# Altium schematic sheet power.SchDoc
size A4
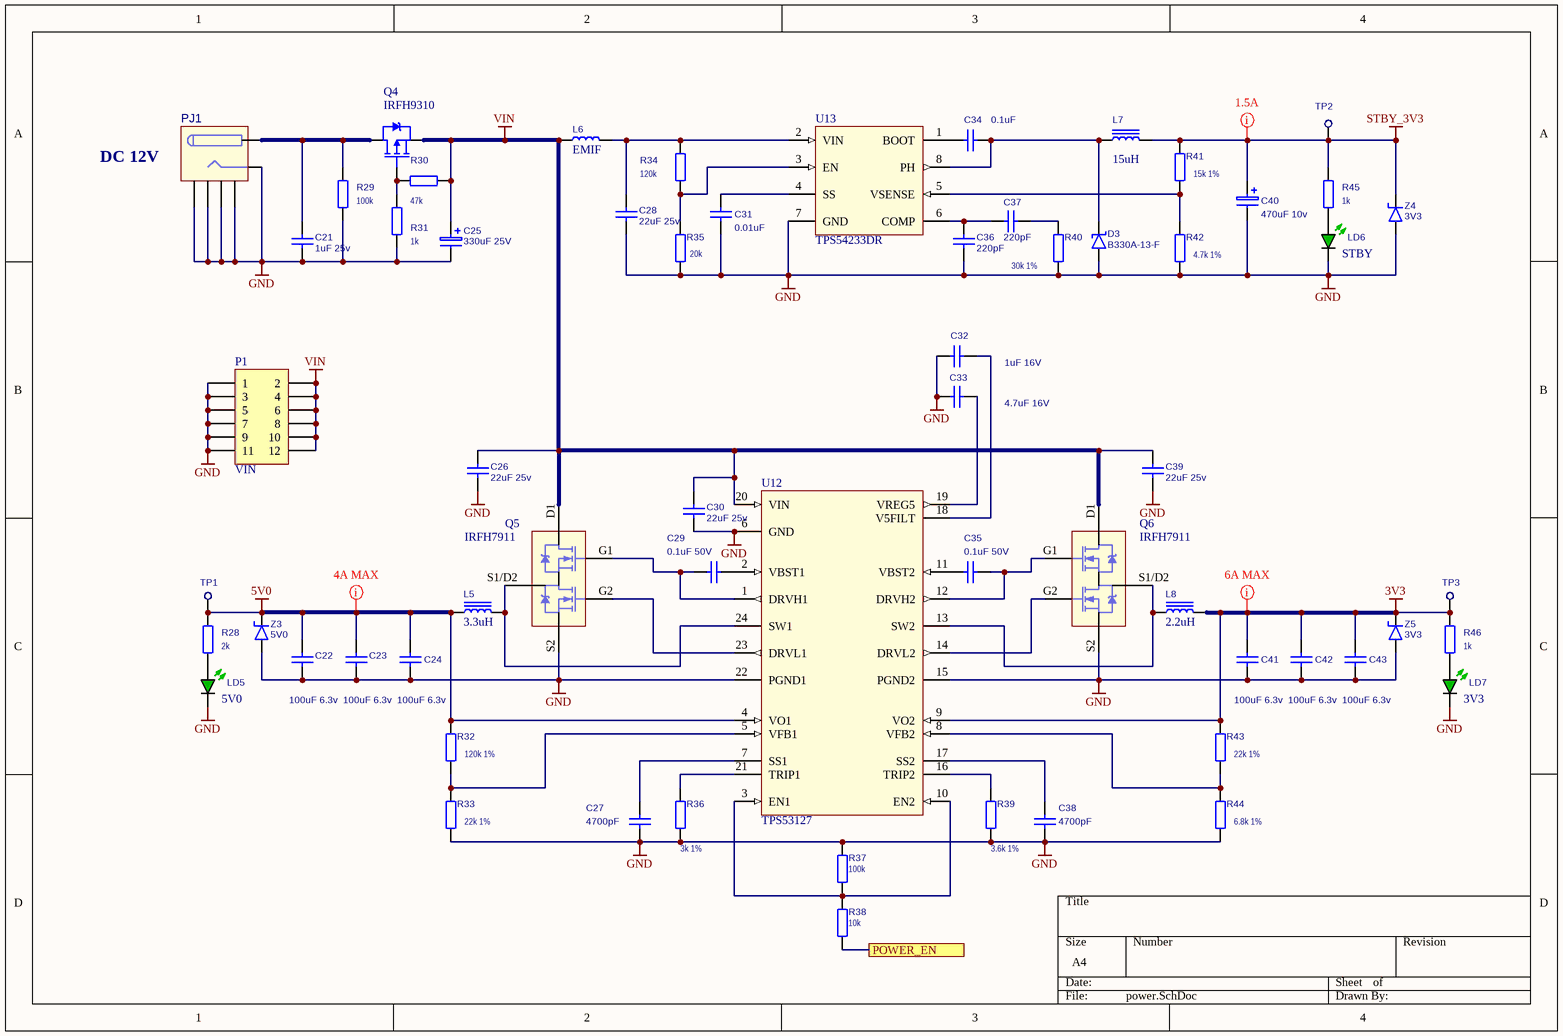
[diagram p0: power.SchDoc]

## Parts
C21  value 1uF 25v  [C0805]  (hidden comment: CL21B105KAFNNNE)
C22  value 100uF 6.3v  [C1206]  (hidden comment: CL31A107MQHNNNE)
C23  value 100uF 6.3v  [C1206]  (hidden comment: CL31A107MQHNNNE)
C24  value 100uF 6.3v  [C1206]  (hidden comment: CL31A107MQHNNNE)
C25  value 330uF 25V  [R08H04]  (hidden comment: ECAP 330/25V 0811 105'C)
C26  value 22uF 25v  [C0805]  (hidden comment: CL21A226MAQNNNE)
C27  value 4700pF  [C0603]  (hidden comment: CL10B472KB8NNNC)
C28  value 22uF 25v  [C0805]  (hidden comment: CL21A226MAQNNNE)
C29  value 0.1uF 50V  [C0603]  (hidden comment: C1608X7R1H104K080AA)
C30  value 22uF 25v  [C0805]  (hidden comment: CL21A226MAQNNNE)
C31  value 0.01uF  [C0603]  (hidden comment: CL10B103KB8NNNC)
C32  value 1uF 16V  [C0603]  (hidden comment: GRM188R61H105KAALD)
C33  value 4.7uF 16V  [C0805]  (hidden comment: CL21A475KOFNNNE)
C34  value 0.1uF  [C0603]  (hidden comment: C1608X7R1H104K080AA)
C35  value 0.1uF 50V  [C0603]  (hidden comment: C1608X7R1H104K080AA)
C36  value 220pF  [C0603]  (hidden comment: CL10C221JB8NNNC)
C37  value 220pF  [C0603]  (hidden comment: CL10C221JB8NNNC)
C38  value 4700pF  [C0603]  (hidden comment: CL10B472KB8NNNC)
C39  value 22uF 25v  [C0805]  (hidden comment: CL21A226MAQNNNE)
C40  value 470uF 10v  [R06H11]  (hidden comment: ECAP 470/10V 0611 105'C)
C41  value 100uF 6.3v  [C1206]  (hidden comment: CL31A107MQHNNNE)
C42  value 100uF 6.3v  [C1206]  (hidden comment: CL31A107MQHNNNE)
C43  value 100uF 6.3v  [C1206]  (hidden comment: CL31A107MQHNNNE)
D3  B330A-13-F  [SMA]
L5  value 3.3uH  [IHLP-2525CZ]  (hidden comment: IHLP2525CZER3R3M01)
L6  value EMIF  [IND0805]  (hidden comment: BLM21PG221SN1D)
L7  value 15uH  [CDRH104R]  (hidden comment: CDRH104RNP-150NC)
L8  value 2.2uH  [IHLP-2525CZ]  (hidden comment: IHLP2525CZER2R2M01)
LD5  value 5V0  [LED0805]  (hidden comment: LED_G)
LD6  value STBY  [LED0805]  (hidden comment: LED_G)
LD7  value 3V3  [LED0805]  (hidden comment: LED_G)
P1  VIN  [PLD-6]
PJ1  PJ-082BH  [PJ-082BH]  (value not drawn)
Q4  IRFH9310  [PQFN_5X6]
Q5  value IRFH7911  [PQFN5X6_DUAL]  (hidden comment: IRFH7911TR2PBF)
Q6  value IRFH7911  [PQFN5X6_DUAL]  (hidden comment: IRFH7911TR2PBF)
R28  2k  [R0603]
R29  100k  [R0603]
R30  47k  [R0603]
R31  1k  [R0603]
R32  120k 1%  [R0603]
R33  22k 1%  [R0603]
R34  120k  [R0603]
R35  20k  [R0603]
R36  3k 1%  [R0603]
R37  100k  [R0603]
R38  10k  [R0603]
R39  3.6k 1%  [R0603]
R40  30k 1%  [R0603]
R41  15k 1%  [R0603]
R42  4.7k 1%  [R0603]
R43  22k 1%  [R0603]
R44  6.8k 1%  [R0603]
R45  1k  [R0603]
R46  1k  [R0603]
TP1  TEST-POINT  [PAD]  (value not drawn)
TP2  TEST-POINT  [PAD]  (value not drawn)
TP3  TEST-POINT  [PAD]  (value not drawn)
U12  TPS53127  [TSSOP-24]
U13  TPS54233DR  [D008_N]
Z3  value 5V0  [SMB]  (hidden comment: SMBJ5.0A-TR)
Z4  value 3V3  [SMB]  (hidden comment: SMBJ3V3-E3/52)
Z5  value 3V3  [SMB]  (hidden comment: SMBJ3V3-E3/52)

## Ports
POWER_EN

## Nets
3V3: C41.2 C42.2 C43.2 L8.2 R43.1 R46.2 TP3.1 U12.9(VO2) Z5.2(K)
5V0: C22.1 C23.1 C24.2 L5.1 R28.2 R32.1 TP1.1 U12.4(VO1) Z3.2(K)
GND: C21.2 C22.2 C23.2 C24.1 C25.2(-) C26.1 C27.1 C28.1 C30.1 C31.1 C32.1 C33.2 C36.1 C38.1 C39.1 C40.2(-) C41.1 C42.1 C43.1 D3.1(A) LD5.1 LD6.1 LD7.1 P1.1 P1.3 P1.5 P1.7 P1.9 P1.11 PJ1.2 PJ1.MH1 PJ1.MH2 PJ1.MH3 PJ1.MH4 Q5.S2 Q6.S2 R29.2 R31.2 R33.2 R35.2 R36.2 R37.1 R39.2 R40.2 R42.2 R44.2 U12.6(GND) U12.15(PGND2) U12.22(PGND1) U13.7(GND) Z3.1(A) Z4.1(A) Z5.1(A)
STBY_3V3: C40.1(+) L7.2 R41.1 R45.2 TP2.1 Z4.2(K)
VIN: C25.1(+) C26.2 C30.2 C39.2 L6.2 P1.2 P1.4 P1.6 P1.8 P1.10 P1.12 Q4.2(S) Q5.D1 Q6.D1 R30.2 U12.20(VIN)
POWER_EN: R38.1 ; port POWER_EN
NetC21_1: C21.1 PJ1.1 Q4.3(D) R29.1
NetC27_2: C27.2 U12.7(SS1)
NetC28_2: C28.2 L6.1 R34.1 U13.2(VIN)
NetC29_1: C29.1 U12.2(VBST1)
NetC29_2: C29.2 Q5.G1 U12.1(DRVH1)
NetC31_2: C31.2 U13.4(SS)
NetC32_2: C32.2 U12.18(V5FILT)
NetC33_1: C33.1 U12.19(VREG5)
NetC34_1: C34.1 D3.2(K) L7.1 U13.8(PH)
NetC34_2: C34.2 U13.1(BOOT)
NetC35_1: C35.1 Q6.G1 U12.12(DRVH2)
NetC35_2: C35.2 U12.11(VBST2)
NetC36_2: C36.2 C37.1 U13.6(COMP)
NetC37_2: C37.2 R40.1
NetC38_2: C38.2 U12.17(SS2)
NetL5_2: L5.2 Q5.S1/D2 U12.24(SW1)
NetL8_1: L8.1 Q6.S1/D2 U12.13(SW2)
NetLD5_2: LD5.2 R28.1
NetLD6_2: LD6.2 R45.1
NetLD7_2: LD7.2 R46.1
NetQ4_1: Q4.1(G) R30.1 R31.1
NetQ5_G2: Q5.G2 U12.23(DRVL1)
NetQ6_G2: Q6.G2 U12.14(DRVL2)
NetR32_2: R32.2 R33.1 U12.5(VFB1)
NetR34_2: R34.2 R35.1 U13.3(EN)
NetR36_1: R36.1 U12.21(TRIP1)
NetR37_2: R37.2 R38.2 U12.3(EN1) U12.10(EN2)
NetR39_1: R39.1 U12.16(TRIP2)
NetR41_2: R41.2 R42.1 U13.5(VSENSE)
NetR43_2: R43.2 R44.1 U12.8(VFB2)

## Layout directives
mark named 1.5A: STBY_3V3
mark named 4A MAX: 5V0
mark named 6A MAX: 3V3

## Notes on the sheet
- (near PJ1) DC 12V

## Library data of the parts
C21-C24 C26-C39 C41-C43 = CAP_NPOL
C25 C40 = CAP_POL
D3 = SHOTTKY: Value: B330A-13-F
L5 L7 L8 = IND_W_IRON
L6 = IND_WO_IRON
LD5-LD7 = LED_GREEN: LED Green
P1 = HDR 6X2: Header, 6-Pin, Dual row; LatestRevisionDate: 17-Jul-2002; LatestRevisionNote: Re-released for DXP Platform.; Publisher: Altium Limited
PJ1 = PowerJack 2P: Value: PowerJack 2P
Q4 = P-Channel: HEXFET Power MOSFET; Value: IRFH9310
Q5 Q6 = IRFH7911: HEXFET Power MOSFET
R28-R46 = RESISTOR: RES
  R28: Value: 2k
  R29 R37: Value: 100k
  R30: Value: 47k
  R31 R45 R46: Value: 1k
  R32: Value: 120k 1%
  R33 R43: Value: 22k 1%
  R34: Value: 120k
  R35: Value: 20k
  R36: Value: 3k 1%
  R38: Value: 10k
  R39: Value: 3.6k 1%
  R40: Value: 30k 1%
  R41: Value: 15k 1%
  R42: Value: 4.7k 1%
  R44: Value: 6.8k 1%
TP1-TP3 = TEST-POINT: PCB terminal block; Value: *
U12 = TPS53127: Dual Synchronous Step-Down Controller  For Low Voltage Power Rails; value: TPS53127
U13 = TPS54232: TPS54232 2-A, 28-V, 300kHz, Step-Down DC-DC Converter With Eco-Mode™; value: TPS54233
Z3-Z5 = ZENNER_1: ZENNER